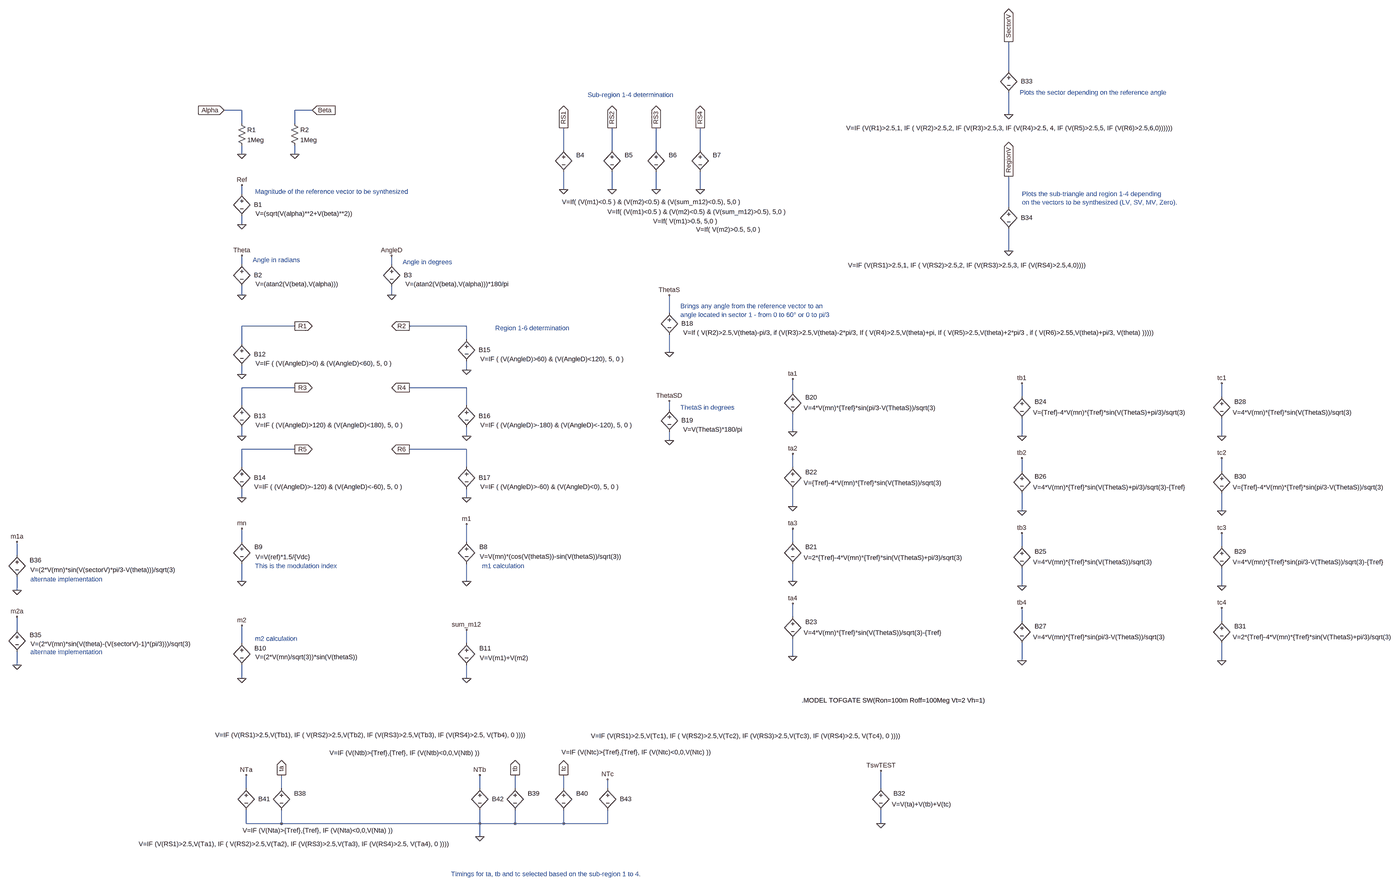
[diagram p0: schematic AlphaBetaTimings.asc, whole sheet]
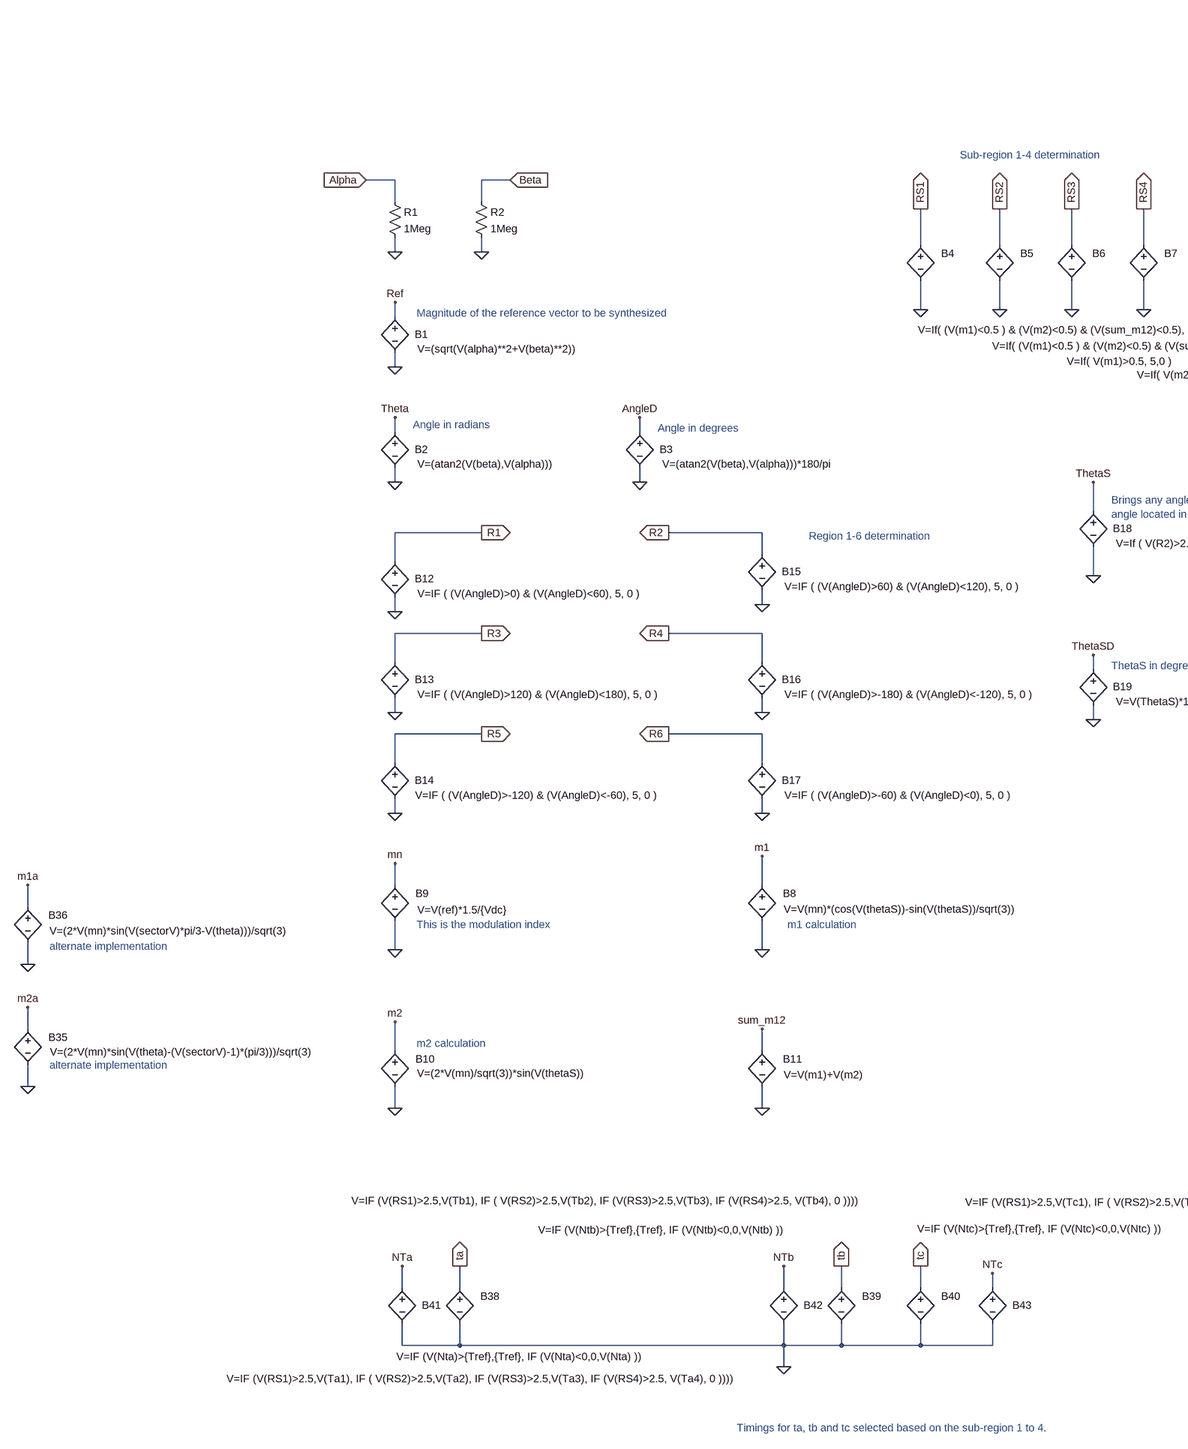
[diagram p1: schematic AlphaBetaTimings.asc, part, row 1 of 1, column 1 of 2]
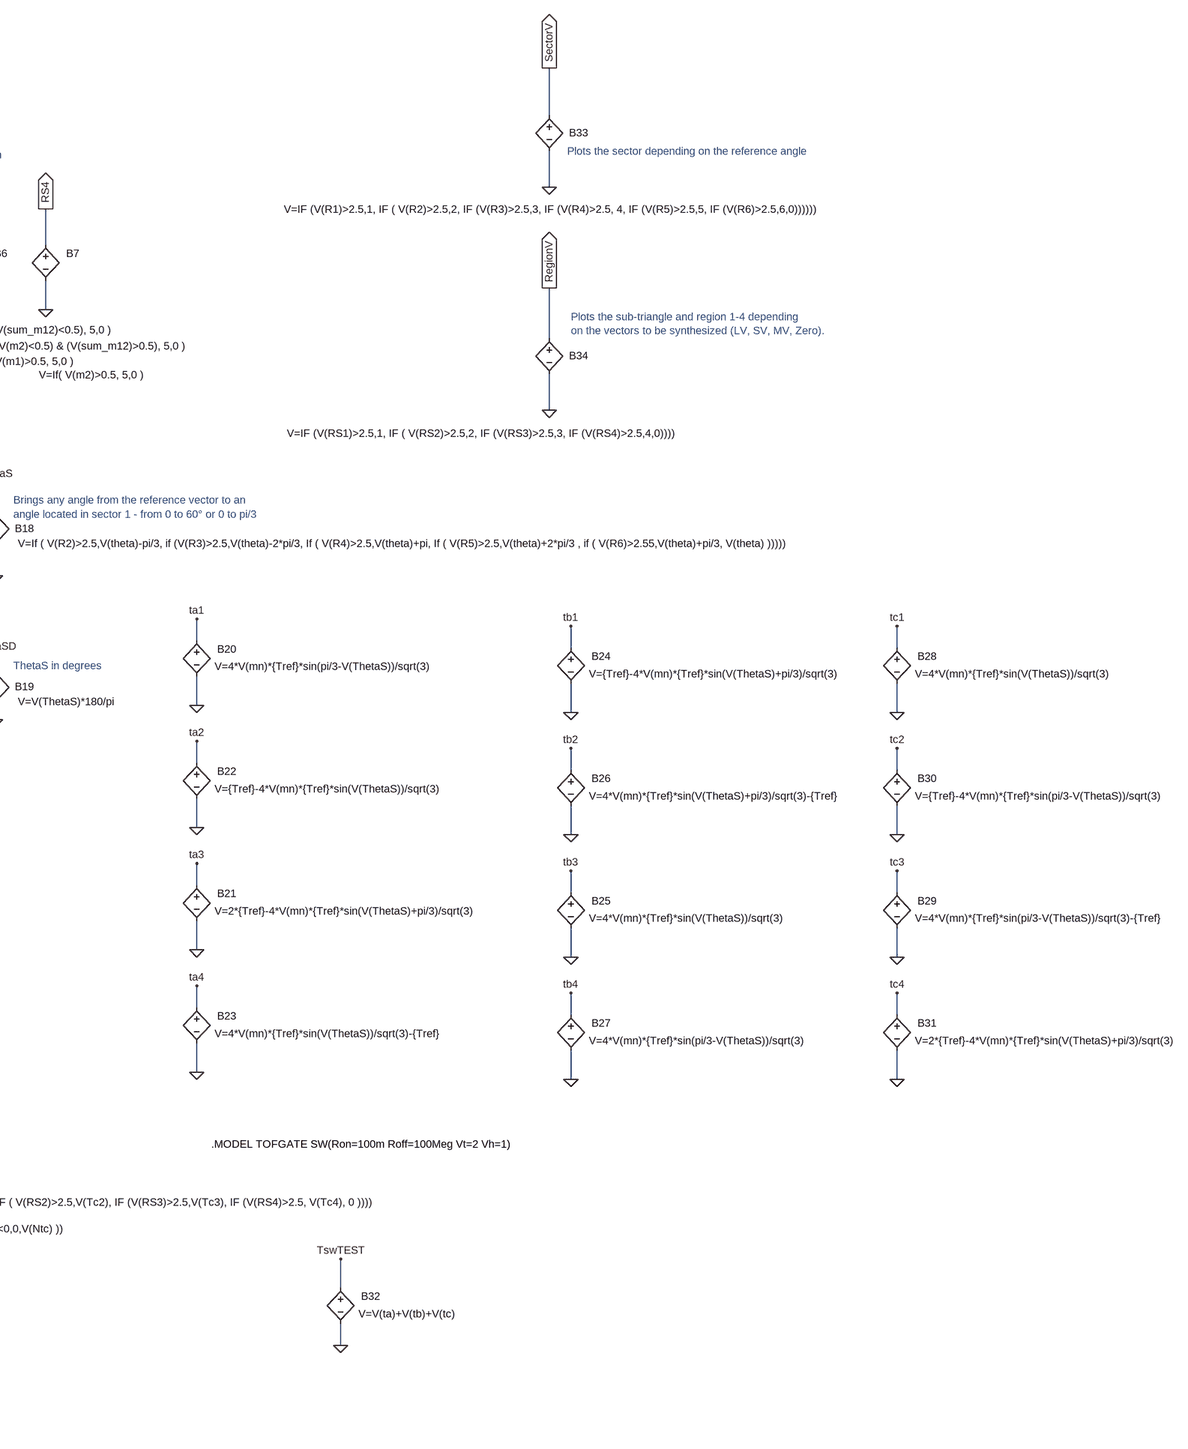
[diagram p2: schematic AlphaBetaTimings.asc, part, row 1 of 1, column 2 of 2]
AlphaBetaTimings.asc, the LTspice schematic file:
Version 4.1
SHEET 1 4632 3756
WIRE 3024 -32 3024 -144
WIRE 240 112 176 112
WIRE 496 112 432 112
WIRE 3024 128 3024 48
WIRE 240 160 240 112
WIRE 432 160 432 112
WIRE 1408 256 1408 176
WIRE 1584 256 1584 176
WIRE 1744 256 1744 176
WIRE 1904 256 1904 176
WIRE 240 272 240 240
WIRE 432 272 432 240
WIRE 1408 400 1408 336
WIRE 1584 400 1584 336
WIRE 1744 400 1744 336
WIRE 1904 400 1904 336
WIRE 240 416 240 384
WIRE 3024 464 3024 352
WIRE 240 528 240 496
WIRE 3024 624 3024 544
WIRE 240 672 240 640
WIRE 784 672 784 640
WIRE 240 784 240 752
WIRE 784 784 784 752
WIRE 1792 848 1792 784
WIRE 432 896 240 896
WIRE 1056 896 848 896
WIRE 1056 944 1056 896
WIRE 240 960 240 896
WIRE 1792 992 1792 928
WIRE 1056 1056 1056 1024
WIRE 240 1072 240 1040
WIRE 432 1120 240 1120
WIRE 1056 1120 848 1120
WIRE 2240 1136 2240 1088
WIRE 3072 1152 3072 1104
WIRE 3904 1152 3904 1104
WIRE 240 1184 240 1120
WIRE 1056 1184 1056 1120
WIRE 1792 1200 1792 1168
WIRE 2240 1280 2240 1216
WIRE 240 1296 240 1264
WIRE 1056 1296 1056 1264
WIRE 3072 1296 3072 1232
WIRE 3904 1296 3904 1232
WIRE 1792 1312 1792 1280
WIRE 432 1344 240 1344
WIRE 1056 1344 848 1344
WIRE 240 1408 240 1344
WIRE 1056 1408 1056 1344
WIRE 2240 1408 2240 1360
WIRE 3072 1424 3072 1376
WIRE 3904 1424 3904 1376
WIRE 240 1520 240 1488
WIRE 1056 1520 1056 1488
WIRE 2240 1552 2240 1488
WIRE 3072 1568 3072 1504
WIRE 3904 1568 3904 1504
WIRE 240 1680 240 1632
WIRE 1056 1680 1056 1616
WIRE 2240 1680 2240 1632
WIRE 3072 1696 3072 1648
WIRE 3904 1696 3904 1648
WIRE -576 1728 -576 1680
WIRE 240 1824 240 1760
WIRE 1056 1824 1056 1760
WIRE 2240 1824 2240 1760
WIRE 3072 1840 3072 1776
WIRE 3904 1840 3904 1776
WIRE -576 1856 -576 1808
WIRE 2240 1952 2240 1904
WIRE 3072 1968 3072 1920
WIRE 3904 1968 3904 1920
WIRE -576 2000 -576 1952
WIRE 240 2048 240 1984
WIRE 1056 2048 1056 2000
WIRE 2240 2096 2240 2032
WIRE 3072 2112 3072 2048
WIRE 3904 2112 3904 2048
WIRE -576 2128 -576 2080
WIRE 240 2176 240 2128
WIRE 1056 2176 1056 2128
WIRE 256 2592 256 2544
WIRE 384 2592 384 2544
WIRE 1104 2592 1104 2544
WIRE 1232 2592 1232 2544
WIRE 1408 2592 1408 2544
WIRE 1568 2592 1568 2560
WIRE 2560 2592 2560 2528
WIRE 256 2720 256 2672
WIRE 384 2720 384 2672
WIRE 384 2720 256 2720
WIRE 1104 2720 1104 2672
WIRE 1104 2720 384 2720
WIRE 1232 2720 1232 2672
WIRE 1232 2720 1104 2720
WIRE 1408 2720 1408 2672
WIRE 1408 2720 1232 2720
WIRE 1568 2720 1568 2672
WIRE 1568 2720 1408 2720
WIRE 2560 2720 2560 2672
WIRE 1104 2768 1104 2720
FLAG 240 528 0
FLAG 240 384 Ref
FLAG 240 784 0
FLAG 240 640 Theta
FLAG 784 784 0
FLAG 784 640 AngleD
FLAG 240 272 0
FLAG 432 272 0
FLAG 176 112 Alpha
IOPIN 176 112 In
FLAG 496 112 Beta
IOPIN 496 112 In
FLAG 1408 400 0
FLAG 1408 176 RS1
IOPIN 1408 176 Out
FLAG 1584 400 0
FLAG 1584 176 RS2
IOPIN 1584 176 Out
FLAG 1744 400 0
FLAG 1744 176 RS3
IOPIN 1744 176 Out
FLAG 1904 400 0
FLAG 1904 176 RS4
IOPIN 1904 176 Out
FLAG 432 896 R1
IOPIN 432 896 Out
FLAG 1056 1824 0
FLAG 240 1824 0
FLAG 240 1632 mn
FLAG 1056 1616 m1
FLAG 240 2176 0
FLAG 240 1984 m2
FLAG 1056 2176 0
FLAG 1056 2000 sum_m12
FLAG 240 1072 0
FLAG 240 1296 0
FLAG 432 1344 R5
IOPIN 432 1344 Out
FLAG 240 1520 0
FLAG 848 896 R2
IOPIN 848 896 Out
FLAG 1056 1056 0
FLAG 848 1120 R4
IOPIN 848 1120 Out
FLAG 1056 1296 0
FLAG 848 1344 R6
IOPIN 848 1344 Out
FLAG 1056 1520 0
FLAG 1792 784 ThetaS
FLAG 1792 992 0
FLAG 1792 1312 0
FLAG 1792 1168 ThetaSD
FLAG 2240 1280 0
FLAG 2240 1088 ta1
FLAG 2240 1824 0
FLAG 2240 1632 ta3
FLAG 2240 1552 0
FLAG 2240 1360 ta2
FLAG 2240 2096 0
FLAG 2240 1904 ta4
FLAG 3072 1296 0
FLAG 3072 1104 tb1
FLAG 3072 1840 0
FLAG 3072 1648 tb3
FLAG 3072 1568 0
FLAG 3072 1376 tb2
FLAG 3072 2112 0
FLAG 3072 1920 tb4
FLAG 3904 1296 0
FLAG 3904 1104 tc1
FLAG 3904 1840 0
FLAG 3904 1648 tc3
FLAG 3904 1568 0
FLAG 3904 1376 tc2
FLAG 3904 2112 0
FLAG 3904 1920 tc4
FLAG 2560 2720 0
FLAG 2560 2528 TswTEST
FLAG 3024 128 0
FLAG 3024 -144 SectorV
IOPIN 3024 -144 Out
FLAG 3024 624 0
FLAG 3024 352 RegionV
IOPIN 3024 352 Out
FLAG 432 1120 R3
IOPIN 432 1120 Out
FLAG 384 2544 ta
IOPIN 384 2544 Out
FLAG 1232 2544 tb
IOPIN 1232 2544 Out
FLAG 1408 2544 tc
IOPIN 1408 2544 Out
FLAG 1104 2768 0
FLAG 256 2544 NTa
FLAG 1104 2544 NTb
FLAG 1568 2560 NTc
FLAG -576 1856 0
FLAG -576 2128 0
FLAG -576 1680 m1a
FLAG -576 1952 m2a
SYMBOL bv 240 400 R0
WINDOW 0 44 55 Left 2
WINDOW 3 50 88 Left 2
SYMATTR InstName B1
SYMATTR Value V=(sqrt(V(alpha)**2+V(beta)**2))
SYMBOL bv 240 656 R0
WINDOW 0 44 55 Left 2
WINDOW 3 50 88 Left 2
SYMATTR InstName B2
SYMATTR Value V=(atan2(V(beta),V(alpha)))
SYMBOL bv 784 656 R0
WINDOW 0 44 55 Left 2
WINDOW 3 50 88 Left 2
SYMATTR InstName B3
SYMATTR Value V=(atan2(V(beta),V(alpha)))*180/pi
SYMBOL res 224 144 R0
SYMATTR InstName R1
SYMATTR Value 1Meg
SYMBOL res 416 144 R0
SYMATTR InstName R2
SYMATTR Value 1Meg
SYMBOL bv 1408 240 R0
WINDOW 0 46 35 Left 2
WINDOW 3 -6 205 Left 2
SYMATTR InstName B4
SYMATTR Value V=If( (V(m1)<0.5 ) & (V(m2)<0.5) & (V(sum_m12)<0.5), 5,0 )
SYMBOL bv 1584 240 R0
WINDOW 0 46 35 Left 2
WINDOW 3 -17 241 Left 2
SYMATTR InstName B5
SYMATTR Value V=If( (V(m1)<0.5 ) & (V(m2)<0.5) & (V(sum_m12)>0.5), 5,0 )
SYMBOL bv 1744 240 R0
WINDOW 0 46 35 Left 2
WINDOW 3 -11 275 Left 2
SYMATTR InstName B6
SYMATTR Value V=If( V(m1)>0.5, 5,0 )
SYMBOL bv 1904 240 R0
WINDOW 0 46 35 Left 2
WINDOW 3 -15 305 Left 2
SYMATTR InstName B7
SYMATTR Value V=If( V(m2)>0.5, 5,0 )
SYMBOL bv 1056 1664 R0
WINDOW 0 46 35 Left 2
WINDOW 3 48 70 Left 2
SYMATTR InstName B8
SYMATTR Value V=V(mn)*(cos(V(thetaS))-sin(V(thetaS))/sqrt(3))
SYMBOL bv 240 1664 R0
WINDOW 0 46 35 Left 2
WINDOW 3 50 71 Left 2
SYMATTR InstName B9
SYMATTR Value V=V(ref)*1.5/{Vdc}
SYMBOL bv 240 2032 R0
WINDOW 0 46 35 Left 2
WINDOW 3 49 67 Left 2
SYMATTR InstName B10
SYMATTR Value V=(2*V(mn)/sqrt(3))*sin(V(thetaS))
SYMBOL bv 1056 2032 R0
WINDOW 0 46 35 Left 2
WINDOW 3 48 70 Left 2
SYMATTR InstName B11
SYMATTR Value V=V(m1)+V(m2)
SYMBOL bv 240 944 R0
WINDOW 0 44 55 Left 2
WINDOW 3 50 88 Left 2
SYMATTR InstName B12
SYMATTR Value V=IF ( (V(AngleD)>0) & (V(AngleD)<60), 5, 0 )
SYMBOL bv 240 1168 R0
WINDOW 0 44 55 Left 2
WINDOW 3 50 88 Left 2
SYMATTR InstName B13
SYMATTR Value V=IF ( (V(AngleD)>120) & (V(AngleD)<180), 5, 0 )
SYMBOL bv 240 1392 R0
WINDOW 0 44 55 Left 2
WINDOW 3 45 88 Left 2
SYMATTR InstName B14
SYMATTR Value V=IF ( (V(AngleD)>-120) & (V(AngleD)<-60), 5, 0 )
SYMBOL bv 1056 928 R0
WINDOW 0 44 55 Left 2
WINDOW 3 50 88 Left 2
SYMATTR InstName B15
SYMATTR Value V=IF ( (V(AngleD)>60) & (V(AngleD)<120), 5, 0 )
SYMBOL bv 1056 1168 R0
WINDOW 0 44 55 Left 2
WINDOW 3 50 88 Left 2
SYMATTR InstName B16
SYMATTR Value V=IF ( (V(AngleD)>-180) & (V(AngleD)<-120), 5, 0 )
SYMBOL bv 1056 1392 R0
WINDOW 0 44 55 Left 2
WINDOW 3 50 88 Left 2
SYMATTR InstName B17
SYMATTR Value V=IF ( (V(AngleD)>-60) & (V(AngleD)<0), 5, 0 )
SYMBOL bv 1792 832 R0
WINDOW 0 44 55 Left 2
WINDOW 3 50 88 Left 2
SYMATTR InstName B18
SYMATTR Value V=If ( V(R2)>2.5,V(theta)-pi/3, if (V(R3)>2.5,V(theta)-2*pi/3, If ( V(R4)>2.5,V(theta)+pi, If ( V(R5)>2.5,V(theta)+2*pi/3 , if ( V(R6)>2.55,V(theta)+pi/3, V(theta) )))))
SYMBOL bv 1792 1184 R0
WINDOW 0 44 55 Left 2
WINDOW 3 50 88 Left 2
SYMATTR InstName B19
SYMATTR Value V=V(ThetaS)*180/pi
SYMBOL bv 2240 1120 R0
WINDOW 0 46 35 Left 2
WINDOW 3 40 74 Left 2
SYMATTR InstName B20
SYMATTR Value V=4*V(mn)*{Tref}*sin(pi/3-V(ThetaS))/sqrt(3)
SYMBOL bv 2240 1664 R0
WINDOW 0 46 35 Left 2
WINDOW 3 40 74 Left 2
SYMATTR InstName B21
SYMATTR Value V=2*{Tref}-4*V(mn)*{Tref}*sin(V(ThetaS)+pi/3)/sqrt(3)
SYMBOL bv 2240 1392 R0
WINDOW 0 46 35 Left 2
WINDOW 3 40 74 Left 2
SYMATTR InstName B22
SYMATTR Value V={Tref}-4*V(mn)*{Tref}*sin(V(ThetaS))/sqrt(3)
SYMBOL bv 2240 1936 R0
WINDOW 0 46 35 Left 2
WINDOW 3 40 74 Left 2
SYMATTR InstName B23
SYMATTR Value V=4*V(mn)*{Tref}*sin(V(ThetaS))/sqrt(3)-{Tref}
SYMBOL bv 3072 1136 R0
WINDOW 0 46 35 Left 2
WINDOW 3 40 74 Left 2
SYMATTR InstName B24
SYMATTR Value V={Tref}-4*V(mn)*{Tref}*sin(V(ThetaS)+pi/3)/sqrt(3)
SYMBOL bv 3072 1680 R0
WINDOW 0 46 35 Left 2
WINDOW 3 40 74 Left 2
SYMATTR InstName B25
SYMATTR Value V=4*V(mn)*{Tref}*sin(V(ThetaS))/sqrt(3)
SYMBOL bv 3072 1408 R0
WINDOW 0 46 35 Left 2
WINDOW 3 40 74 Left 2
SYMATTR InstName B26
SYMATTR Value V=4*V(mn)*{Tref}*sin(V(ThetaS)+pi/3)/sqrt(3)-{Tref}
SYMBOL bv 3072 1952 R0
WINDOW 0 46 35 Left 2
WINDOW 3 40 74 Left 2
SYMATTR InstName B27
SYMATTR Value V=4*V(mn)*{Tref}*sin(pi/3-V(ThetaS))/sqrt(3)
SYMBOL bv 3904 1136 R0
WINDOW 0 46 35 Left 2
WINDOW 3 40 74 Left 2
SYMATTR InstName B28
SYMATTR Value V=4*V(mn)*{Tref}*sin(V(ThetaS))/sqrt(3)
SYMBOL bv 3904 1680 R0
WINDOW 0 46 35 Left 2
WINDOW 3 40 74 Left 2
SYMATTR InstName B29
SYMATTR Value V=4*V(mn)*{Tref}*sin(pi/3-V(ThetaS))/sqrt(3)-{Tref}
SYMBOL bv 3904 1408 R0
WINDOW 0 46 35 Left 2
WINDOW 3 40 74 Left 2
SYMATTR InstName B30
SYMATTR Value V={Tref}-4*V(mn)*{Tref}*sin(pi/3-V(ThetaS))/sqrt(3)
SYMBOL bv 3904 1952 R0
WINDOW 0 46 35 Left 2
WINDOW 3 40 74 Left 2
SYMATTR InstName B31
SYMATTR Value V=2*{Tref}-4*V(mn)*{Tref}*sin(V(ThetaS)+pi/3)/sqrt(3)
SYMBOL bv 2560 2576 R0
WINDOW 0 46 35 Left 2
WINDOW 3 40 74 Left 2
SYMATTR InstName B32
SYMATTR Value V=V(ta)+V(tb)+V(tc)
SYMBOL bv 3024 -48 R0
WINDOW 0 44 55 Left 2
WINDOW 3 -590 225 Left 2
SYMATTR InstName B33
SYMATTR Value V=IF (V(R1)>2.5,1, IF ( V(R2)>2.5,2, IF (V(R3)>2.5,3, IF (V(R4)>2.5, 4, IF (V(R5)>2.5,5, IF (V(R6)>2.5,6,0))))))
SYMBOL bv 3024 448 R0
WINDOW 0 44 55 Left 2
WINDOW 3 -583 227 Left 2
SYMATTR InstName B34
SYMATTR Value V=IF (V(RS1)>2.5,1, IF ( V(RS2)>2.5,2, IF (V(RS3)>2.5,3, IF (V(RS4)>2.5,4,0))))
SYMBOL bv 384 2576 R0
WINDOW 0 46 35 Left 2
WINDOW 3 -141 169 Left 2
SYMATTR InstName B38
SYMATTR Value V=IF (V(Nta)>{Tref},{Tref}, IF (V(Nta)<0,0,V(Nta) ))
SYMBOL bv 1232 2576 R0
WINDOW 0 46 35 Left 2
WINDOW 3 -674 -112 Left 2
SYMATTR InstName B39
SYMATTR Value V=IF (V(Ntb)>{Tref},{Tref}, IF (V(Ntb)<0,0,V(Ntb) ))
SYMBOL bv 1408 2576 R0
WINDOW 0 46 35 Left 2
WINDOW 3 -7 -115 Left 2
SYMATTR InstName B40
SYMATTR Value V=IF (V(Ntc)>{Tref},{Tref}, IF (V(Ntc)<0,0,V(Ntc) ))
SYMBOL bv 256 2576 R0
WINDOW 0 44 55 Left 2
WINDOW 3 -390 219 Left 2
SYMATTR InstName B41
SYMATTR Value V=IF (V(RS1)>2.5,V(Ta1), IF ( V(RS2)>2.5,V(Ta2), IF (V(RS3)>2.5,V(Ta3), IF (V(RS4)>2.5, V(Ta4), 0 ))))
SYMBOL bv 1104 2576 R0
WINDOW 0 44 55 Left 2
WINDOW 3 -961 -177 Left 2
SYMATTR InstName B42
SYMATTR Value V=IF (V(RS1)>2.5,V(Tb1), IF ( V(RS2)>2.5,V(Tb2), IF (V(RS3)>2.5,V(Tb3), IF (V(RS4)>2.5, V(Tb4), 0 ))))
SYMBOL bv 1568 2576 R0
WINDOW 0 44 55 Left 2
WINDOW 3 -61 -174 Left 2
SYMATTR InstName B43
SYMATTR Value V=IF (V(RS1)>2.5,V(Tc1), IF ( V(RS2)>2.5,V(Tc2), IF (V(RS3)>2.5,V(Tc3), IF (V(RS4)>2.5, V(Tc4), 0 ))))
SYMBOL bv -576 1984 R0
WINDOW 0 46 35 Left 2
WINDOW 3 49 67 Left 2
SYMATTR InstName B35
SYMATTR Value V=(2*V(mn)*sin(V(theta)-(V(sectorV)-1)*(pi/3)))/sqrt(3)
SYMBOL bv -576 1712 R0
WINDOW 0 46 35 Left 2
WINDOW 3 48 70 Left 2
SYMATTR InstName B36
SYMATTR Value V=(2*V(mn)*sin(V(sectorV)*pi/3-V(theta)))/sqrt(3)
TEXT 280 656 Left 2 ;Angle in radians
TEXT 288 408 Left 2 ;Magnitude of the reference vector to be synthesized
TEXT 824 664 Left 2 ;Angle in degrees
TEXT 1496 56 Left 2 ;Sub-region 1-4 determination
TEXT 1112 1768 Left 2 ;m1 calculation
TEXT 288 2032 Left 2 ;m2 calculation
TEXT 1160 904 Left 2 ;Region 1-6 determination
TEXT 288 1768 Left 2 ;This is the modulation index
TEXT 1832 824 Left 2 ;Brings any angle from the reference vector to an \nangle located in sector 1 - from 0 to 60° or 0 to pi/3
TEXT 1832 1192 Left 2 ;ThetaS in degrees
TEXT 1000 2904 Left 2 ;Timings for ta, tb and tc selected based on the sub-region 1 to 4.
TEXT 3064 48 Left 2 ;Plots the sector depending on the reference angle
TEXT 3072 416 Left 2 ;Plots the sub-triangle and region 1-4 depending \non the vectors to be synthesized (LV, SV, MV, Zero).
TEXT 2272 2256 Left 2 !.MODEL TOFGATE SW(Ron=100m Roff=100Meg Vt=2 Vh=1)
TEXT -528 1816 Left 2 ;alternate implementation
TEXT -528 2080 Left 2 ;alternate implementation

The netlist it stands for:
* AlphaBetaTimings.asc
B1 Ref 0 V=(sqrt(V(alpha)**2+V(beta)**2))
B2 Theta 0 V=(atan2(V(beta),V(alpha)))
B3 AngleD 0 V=(atan2(V(beta),V(alpha)))*180/pi
R1 Alpha 0 1Meg
R2 Beta 0 1Meg
B4 RS1 0 V=If( (V(m1)<0.5 ) & (V(m2)<0.5) & (V(sum_m12)<0.5), 5,0 )
B5 RS2 0 V=If( (V(m1)<0.5 ) & (V(m2)<0.5) & (V(sum_m12)>0.5), 5,0 )
B6 RS3 0 V=If( V(m1)>0.5, 5,0 )
B7 RS4 0 V=If( V(m2)>0.5, 5,0 )
B8 m1 0 V=V(mn)*(cos(V(thetaS))-sin(V(thetaS))/sqrt(3))
B9 mn 0 V=V(ref)*1.5/{Vdc}
B10 m2 0 V=(2*V(mn)/sqrt(3))*sin(V(thetaS))
B11 sum_m12 0 V=V(m1)+V(m2)
B12 R1 0 V=IF ( (V(AngleD)>0) & (V(AngleD)<60), 5, 0 )
B13 R3 0 V=IF ( (V(AngleD)>120) & (V(AngleD)<180), 5, 0 )
B14 R5 0 V=IF ( (V(AngleD)>-120) & (V(AngleD)<-60), 5, 0 )
B15 R2 0 V=IF ( (V(AngleD)>60) & (V(AngleD)<120), 5, 0 )
B16 R4 0 V=IF ( (V(AngleD)>-180) & (V(AngleD)<-120), 5, 0 )
B17 R6 0 V=IF ( (V(AngleD)>-60) & (V(AngleD)<0), 5, 0 )
B18 ThetaS 0 V=If ( V(R2)>2.5,V(theta)-pi/3, if (V(R3)>2.5,V(theta)-2*pi/3, If ( V(R4)>2.5,V(theta)+pi, If ( V(R5)>2.5,V(theta)+2*pi/3 , if ( V(R6)>2.55,V(theta)+pi/3, V(theta) )))))
B19 ThetaSD 0 V=V(ThetaS)*180/pi
B20 ta1 0 V=4*V(mn)*{Tref}*sin(pi/3-V(ThetaS))/sqrt(3)
B21 ta3 0 V=2*{Tref}-4*V(mn)*{Tref}*sin(V(ThetaS)+pi/3)/sqrt(3)
B22 ta2 0 V={Tref}-4*V(mn)*{Tref}*sin(V(ThetaS))/sqrt(3)
B23 ta4 0 V=4*V(mn)*{Tref}*sin(V(ThetaS))/sqrt(3)-{Tref}
B24 tb1 0 V={Tref}-4*V(mn)*{Tref}*sin(V(ThetaS)+pi/3)/sqrt(3)
B25 tb3 0 V=4*V(mn)*{Tref}*sin(V(ThetaS))/sqrt(3)
B26 tb2 0 V=4*V(mn)*{Tref}*sin(V(ThetaS)+pi/3)/sqrt(3)-{Tref}
B27 tb4 0 V=4*V(mn)*{Tref}*sin(pi/3-V(ThetaS))/sqrt(3)
B28 tc1 0 V=4*V(mn)*{Tref}*sin(V(ThetaS))/sqrt(3)
B29 tc3 0 V=4*V(mn)*{Tref}*sin(pi/3-V(ThetaS))/sqrt(3)-{Tref}
B30 tc2 0 V={Tref}-4*V(mn)*{Tref}*sin(pi/3-V(ThetaS))/sqrt(3)
B31 tc4 0 V=2*{Tref}-4*V(mn)*{Tref}*sin(V(ThetaS)+pi/3)/sqrt(3)
B32 TswTEST 0 V=V(ta)+V(tb)+V(tc)
B33 SectorV 0 V=IF (V(R1)>2.5,1, IF ( V(R2)>2.5,2, IF (V(R3)>2.5,3, IF (V(R4)>2.5, 4, IF (V(R5)>2.5,5, IF (V(R6)>2.5,6,0))))))
B34 RegionV 0 V=IF (V(RS1)>2.5,1, IF ( V(RS2)>2.5,2, IF (V(RS3)>2.5,3, IF (V(RS4)>2.5,4,0))))
B38 ta 0 V=IF (V(Nta)>{Tref},{Tref}, IF (V(Nta)<0,0,V(Nta) ))
B39 tb 0 V=IF (V(Ntb)>{Tref},{Tref}, IF (V(Ntb)<0,0,V(Ntb) ))
B40 tc 0 V=IF (V(Ntc)>{Tref},{Tref}, IF (V(Ntc)<0,0,V(Ntc) ))
B41 NTa 0 V=IF (V(RS1)>2.5,V(Ta1), IF ( V(RS2)>2.5,V(Ta2), IF (V(RS3)>2.5,V(Ta3), IF (V(RS4)>2.5, V(Ta4), 0 ))))
B42 NTb 0 V=IF (V(RS1)>2.5,V(Tb1), IF ( V(RS2)>2.5,V(Tb2), IF (V(RS3)>2.5,V(Tb3), IF (V(RS4)>2.5, V(Tb4), 0 ))))
B43 NTc 0 V=IF (V(RS1)>2.5,V(Tc1), IF ( V(RS2)>2.5,V(Tc2), IF (V(RS3)>2.5,V(Tc3), IF (V(RS4)>2.5, V(Tc4), 0 ))))
B35 m2a 0 V=(2*V(mn)*sin(V(theta)-(V(sectorV)-1)*(pi/3)))/sqrt(3)
B36 m1a 0 V=(2*V(mn)*sin(V(sectorV)*pi/3-V(theta)))/sqrt(3)
* Angle in radians
* Magnitude of the reference vector to be synthesized
* Angle in degrees
* Sub-region 1-4 determination
* m1 calculation
* m2 calculation
* Region 1-6 determination
* This is the modulation index
* Brings any angle from the reference vector to an
* angle located in sector 1 - from 0 to 60° or 0 to pi/3
* ThetaS in degrees
* Timings for ta, tb and tc selected based on the sub-region 1 to 4.
* Plots the sector depending on the reference angle
* Plots the sub-triangle and region 1-4 depending
* on the vectors to be synthesized (LV, SV, MV, Zero).
.MODEL TOFGATE SW(Ron=100m Roff=100Meg Vt=2 Vh=1)
* alternate implementation
* alternate implementation
.backanno
.end